# Altium schematic sheet M3_LPF.SchDoc
size 431 x 279 mm
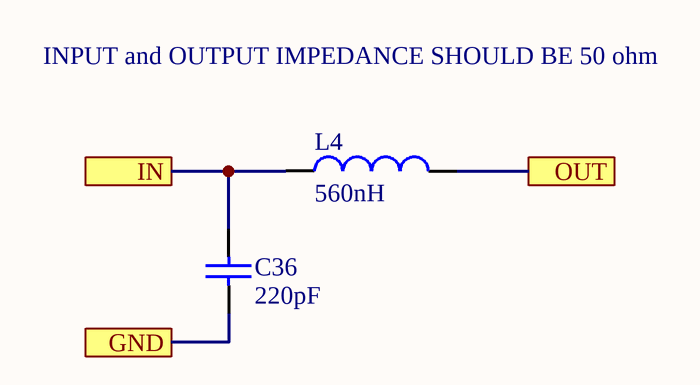
[diagram p0: M3_LPF.SchDoc]

## Parts
C36  220pF  [SMD-0603]
L4  560nH  [SMD-0603]

## Ports
GND, IN, OUT

## Nets
GND: C36.1 ; port GND
IN: C36.2 L4.1 ; port IN
OUT: L4.2 ; port OUT

## Notes on the sheet
- (near L4) INPUT and OUTPUT IMPEDANCE SHOULD BE 50 ohm
- DWG. NO.
- REV.
- SHT.
- THIS DOCUMENT AND THE DATA DISCLOSED HEREIN OR HEREWITH IS THE PROPERTY OF ALTIUM LIMITED AND MAY BE FREELY DISTRIBUTED IN WHOLE. NO RIGHTS ARE RESERVED OR EXPRESS OR IMPLIED WARANTEE GIVEN.
- REVISION
- DESCRIPTION
- DATE
- APPROVED
- ENG:
- APPROVALS
- PROJECT
- DSN:
- CHK:
- REFERENCE DOCUMENTS
- PROJECT REVISION:
- TITLE
- DOCUMENT REVISION:
- DESIGN ITEM:
- BOM:
- FAB DWG:
- PCB DWG:
- ASSY DWG:
- SCALE:
- SIZE
- B
- CAGE CODE
- FILE NAME
- DWG NO.
- SHEET
- OF
- REV

## Library data of the parts
C36 = CAP0603: Ceramic Capacitor 0603
L4 = L0603: Inductor 0603